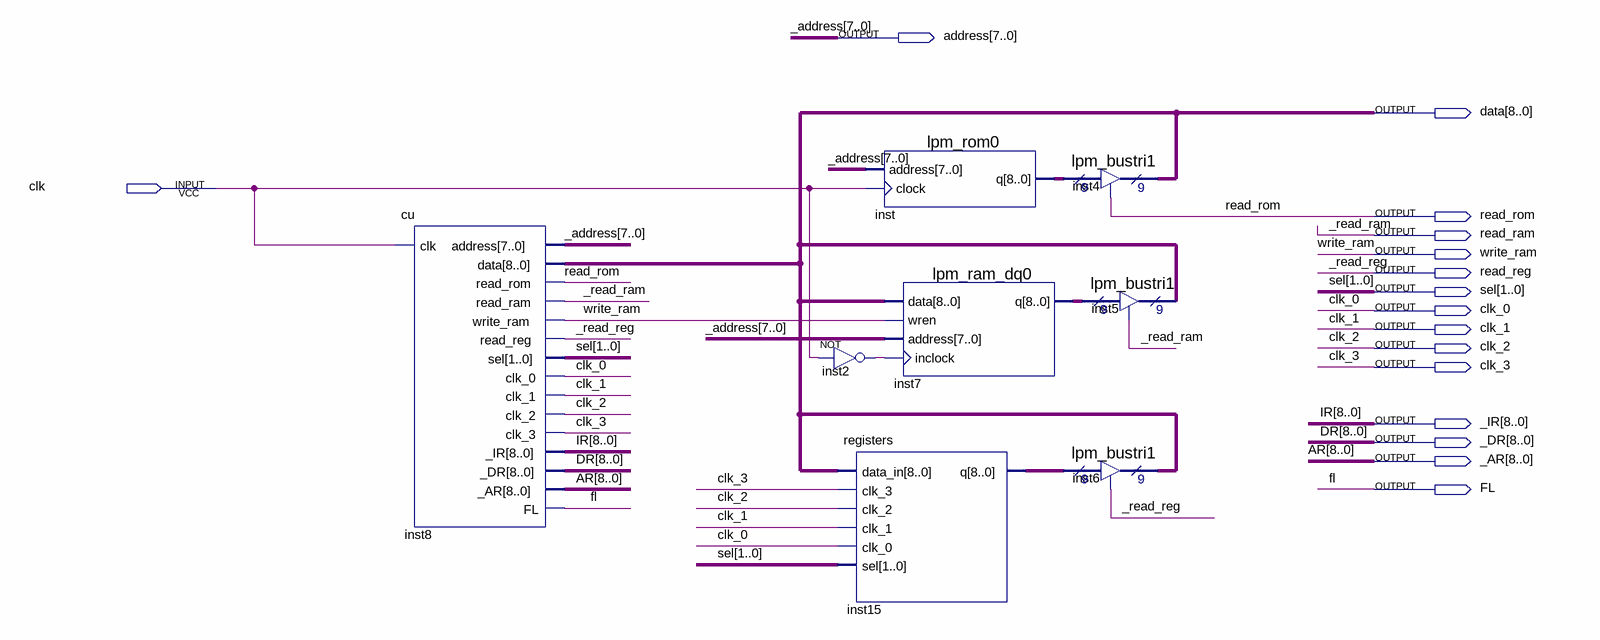
[diagram p0: schematic sheet]
// Quartus schematic lab4.bdf as structural Verilog: 8 symbols, 16 pins
module lab4 (
  input  clk,
  output [7:0] address,
  output [8:0] data,
  output read_rom,
  output read_ram,
  output write_ram,
  output read_reg,
  output [1:0] sel,
  output clk_0,
  output clk_1,
  output clk_2,
  output clk_3,
  output [8:0] _IR,
  output [8:0] _DR,
  output [8:0] _AR,
  output FL
);

  wire inst2_out;
  wire [8:0] inst7_q, inst15_q, inst_q;

  cu inst8 (
    .clk(clk), .address(address), .read_rom(read_rom), .read_ram(read_ram), .write_ram(write_ram),
    .read_reg(read_reg), .sel(sel), .clk_0(clk_0), .clk_1(clk_1), .clk_2(clk_2), .clk_3(clk_3), ._IR(_IR),
    ._DR(_DR), ._AR(_AR), .FL(FL), .data(data));
  not inst2 (inst2_out, clk);
  lpm_rom0 inst (.address(address), .clock(clk), .q(inst_q));
  lpm_ram_dq0 inst7 (.data(data), .wren(write_ram), .address(address), .inclock(inst2_out), .q(inst7_q));
  registers inst15 (
    .data_in(data), .clk_3(clk_3), .clk_2(clk_2), .clk_1(clk_1), .clk_0(clk_0), .sel(sel), .q(inst15_q));
  lpm_bustri1 inst4 (.enabledt(read_rom), .data(inst_q), .tridata(data));
  lpm_bustri1 inst5 (.enabledt(read_ram), .data(inst7_q), .tridata(data));
  lpm_bustri1 inst6 (.enabledt(read_reg), .data(inst15_q), .tridata(data));

  // Other names for the same wires on the sheet: _address[7:0] = address; _read_ram = read_ram; _read_reg = read_reg;
  //   AR[8:0] = _AR; DR[8:0] = _DR; IR[8:0] = _IR
endmodule
